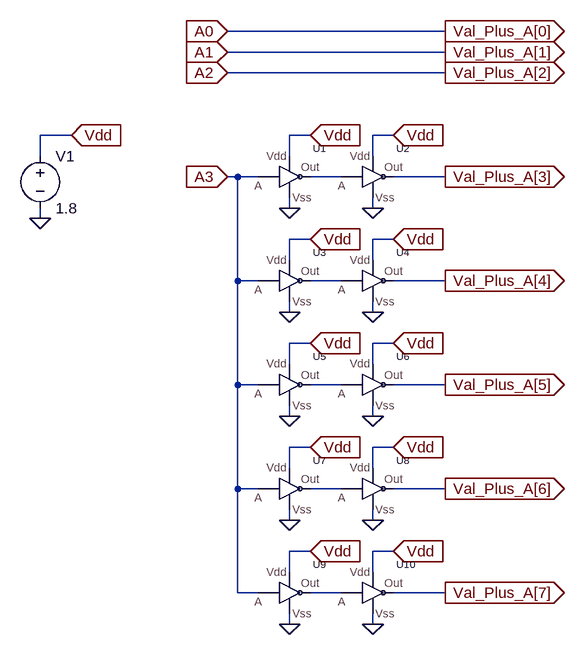
[diagram p0: schematic Val_Plus_A.asc]
Val_Plus_A.asc, the LTspice schematic file:
Version 4
SHEET 1 880 952
WIRE 384 16 48 16
WIRE 384 48 48 48
WIRE 384 80 48 80
WIRE -192 176 -240 176
WIRE 176 176 144 176
WIRE 304 176 272 176
WIRE -240 208 -240 176
WIRE 144 208 144 176
WIRE 272 208 272 176
WIRE 64 240 48 240
WIRE 96 240 64 240
WIRE 224 240 176 240
WIRE 384 240 304 240
WIRE 144 288 144 272
WIRE 272 288 272 272
WIRE -240 304 -240 288
WIRE 176 336 144 336
WIRE 304 336 272 336
WIRE 144 368 144 336
WIRE 272 368 272 336
WIRE 64 400 64 240
WIRE 96 400 64 400
WIRE 224 400 176 400
WIRE 384 400 304 400
WIRE 144 448 144 432
WIRE 272 448 272 432
WIRE 176 496 144 496
WIRE 304 496 272 496
WIRE 144 528 144 496
WIRE 272 528 272 496
WIRE 64 560 64 400
WIRE 96 560 64 560
WIRE 224 560 176 560
WIRE 384 560 304 560
WIRE 144 608 144 592
WIRE 272 608 272 592
WIRE 176 656 144 656
WIRE 304 656 272 656
WIRE 144 688 144 656
WIRE 272 688 272 656
WIRE 64 720 64 560
WIRE 96 720 64 720
WIRE 224 720 176 720
WIRE 384 720 304 720
WIRE 144 768 144 752
WIRE 272 768 272 752
WIRE 176 816 144 816
WIRE 304 816 272 816
WIRE 144 848 144 816
WIRE 272 848 272 816
WIRE 64 880 64 720
WIRE 96 880 64 880
WIRE 224 880 176 880
WIRE 384 880 304 880
WIRE 144 928 144 912
WIRE 272 928 272 912
FLAG 48 16 A0
IOPIN 48 16 In
FLAG 48 48 A1
IOPIN 48 48 In
FLAG 48 80 A2
IOPIN 48 80 In
FLAG 48 240 A3
IOPIN 48 240 In
FLAG 384 16 Val_Plus_A[0]
IOPIN 384 16 Out
FLAG 384 48 Val_Plus_A[1]
IOPIN 384 48 Out
FLAG 384 80 Val_Plus_A[2]
IOPIN 384 80 Out
FLAG 384 240 Val_Plus_A[3]
IOPIN 384 240 Out
FLAG 384 400 Val_Plus_A[4]
IOPIN 384 400 Out
FLAG 384 560 Val_Plus_A[5]
IOPIN 384 560 Out
FLAG 384 720 Val_Plus_A[6]
IOPIN 384 720 Out
FLAG 384 880 Val_Plus_A[7]
IOPIN 384 880 Out
FLAG 176 176 Vdd
IOPIN 176 176 In
FLAG 304 176 Vdd
IOPIN 304 176 In
FLAG 144 288 0
FLAG 272 288 0
FLAG -240 304 0
FLAG -192 176 Vdd
IOPIN -192 176 In
FLAG 176 336 Vdd
IOPIN 176 336 In
FLAG 304 336 Vdd
IOPIN 304 336 In
FLAG 144 448 0
FLAG 272 448 0
FLAG 176 496 Vdd
IOPIN 176 496 In
FLAG 304 496 Vdd
IOPIN 304 496 In
FLAG 144 608 0
FLAG 272 608 0
FLAG 176 656 Vdd
IOPIN 176 656 In
FLAG 304 656 Vdd
IOPIN 304 656 In
FLAG 144 768 0
FLAG 272 768 0
FLAG 176 816 Vdd
IOPIN 176 816 In
FLAG 304 816 Vdd
IOPIN 304 816 In
FLAG 144 928 0
FLAG 272 928 0
SYMBOL NOT1 128 240 R0
SYMATTR InstName U1
SYMBOL NOT1 256 240 R0
SYMATTR InstName U2
SYMBOL voltage -240 192 R0
WINDOW 123 0 0 Left 0
WINDOW 39 0 0 Left 0
SYMATTR InstName V1
SYMATTR Value 1.8
SYMBOL NOT1 128 400 R0
SYMATTR InstName U3
SYMBOL NOT1 256 400 R0
SYMATTR InstName U4
SYMBOL NOT1 128 560 R0
SYMATTR InstName U5
SYMBOL NOT1 256 560 R0
SYMATTR InstName U6
SYMBOL NOT1 128 720 R0
SYMATTR InstName U7
SYMBOL NOT1 256 720 R0
SYMATTR InstName U8
SYMBOL NOT1 128 880 R0
SYMATTR InstName U9
SYMBOL NOT1 256 880 R0
SYMATTR InstName U10

The netlist it stands for:
* Val_Plus_A.asc
XU1 Vdd 0 A3 N001 NOT1  ; pins Vdd Vss A Out
XU2 Vdd 0 N001 Val_Plus_A[3] NOT1  ; pins Vdd Vss A Out
V1 Vdd 0 1.8
XU3 Vdd 0 A3 N002 NOT1  ; pins Vdd Vss A Out
XU4 Vdd 0 N002 Val_Plus_A[4] NOT1  ; pins Vdd Vss A Out
XU5 Vdd 0 A3 N003 NOT1  ; pins Vdd Vss A Out
XU6 Vdd 0 N003 Val_Plus_A[5] NOT1  ; pins Vdd Vss A Out
XU7 Vdd 0 A3 N004 NOT1  ; pins Vdd Vss A Out
XU8 Vdd 0 N004 Val_Plus_A[6] NOT1  ; pins Vdd Vss A Out
XU9 Vdd 0 A3 N005 NOT1  ; pins Vdd Vss A Out
XU10 Vdd 0 N005 Val_Plus_A[7] NOT1  ; pins Vdd Vss A Out
.lib NOT1.sub
.backanno
.end